# Altium project Design Project 2.PrjPcb
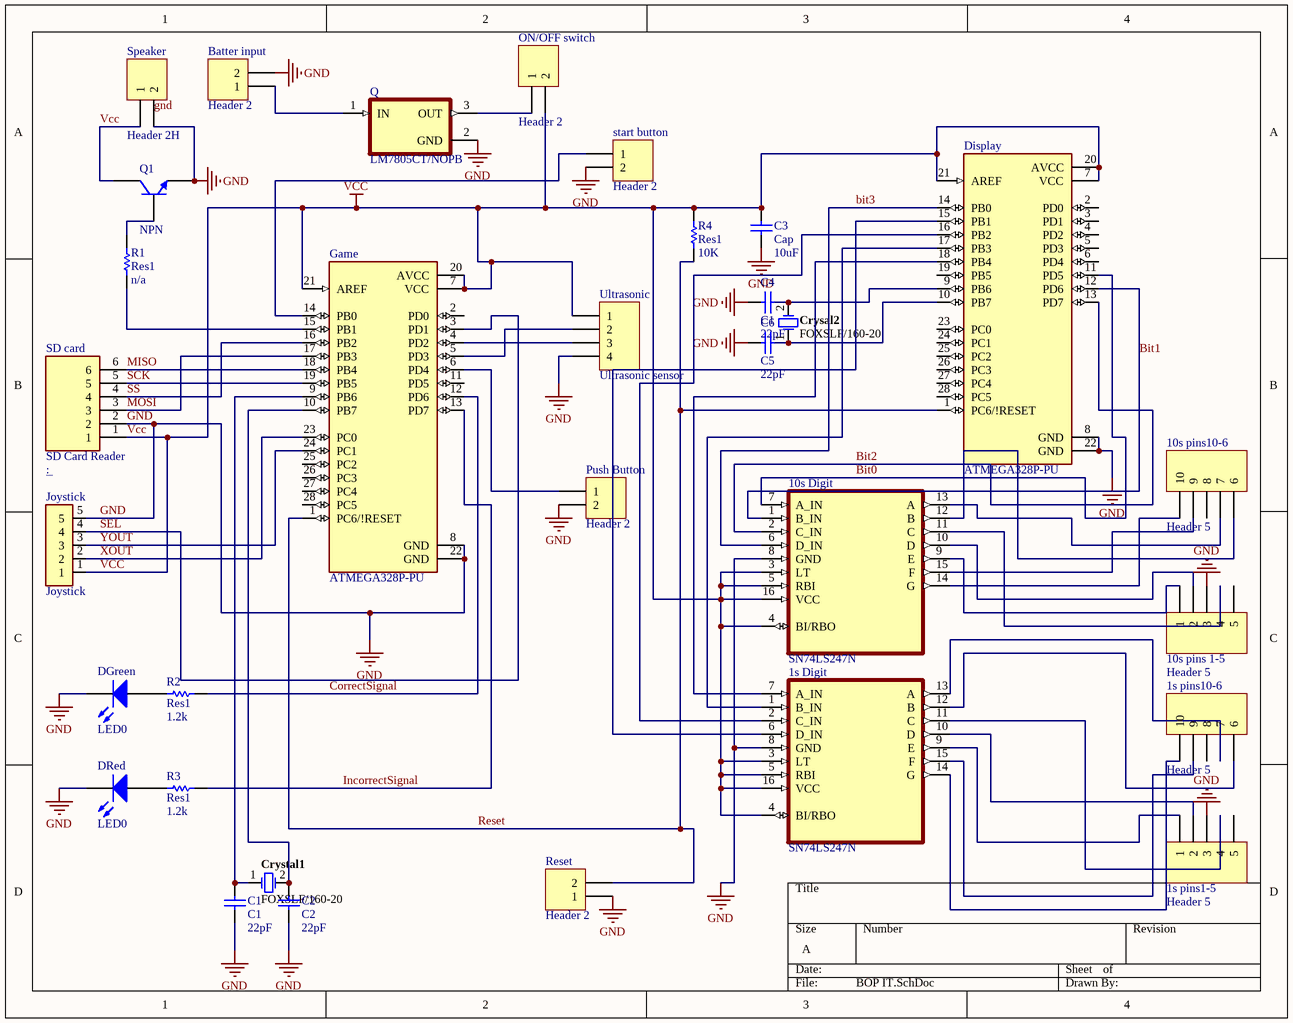
[diagram p0: BOP IT.SchDoc]
1 sheet, 32 parts. Net scope: global (net labels, ports and power ports of the same name join across sheets).
Board file: Bop_it.PcbDoc

## Sheet BOP IT.SchDoc
size A; SheetNumber: 1; SheetTotal: 1

### Parts
1s_Digit  SN74LS247N  [DIP794W45P254L1969H508Q16]
1s_pins1-5  Header 5  [HDR1X5]
1s_pins10-6  Header 5  [HDR1X5]
10s_Digit  SN74LS247N  [DIP794W45P254L1969H508Q16]
10s_pins10-6  Header 5  [HDR1X5]
10s_pins_1-5  Header 5  [HDR1X5]
Batter_input  Header 2  [HDR1X2]
C1  C1  value 22pF  [RAD-0.3]
C2  C2  value 22pF  [RAD-0.3]
C3  Cap  value 10uF  [RAD-0.3]
C4  C1  value 22pF  [RAD-0.3]
C6  C5  value 22pF  [RAD-0.3]
Crysal2  FOXSLF/160-20  [FOX-FOXSLF160-20]
Crystal1  FOXSLF/160-20  [FOX-FOXSLF160-20]
DGreen  LED0  [LED-0]
Display  ATMEGA328P-PU  [DIP794W46P254L2967H457Q28B]
DRed  LED0  [LED-0]
Game  ATMEGA328P-PU  [DIP794W46P254L2967H457Q28B]
Joystick  Joystick  [TE_826629-5]
ON/OFF_switch  Header 2  [HDR1X2]
Push_Button  Header 2  [HDR1X2]
Q  LM7805CT/NOPB  [TO254P1054X470X2600-3]
Q1  NPN  [TO-226-AA]
R1  Res1  [AXIAL-0.3]
R2  Res1  value 1.2k  [AXIAL-0.3]
R3  Res1  value 1.2k  [AXIAL-0.3]
R4  Res1  value 10K  [AXIAL-0.3]
Reset  Header 2  [HDR1X2]
SD_card  SD Card Reader  [TE_5-146285-6]
Speaker  Header 2H  [HDR1X2H]
start_button  Header 2  [HDR1X2]
Ultrasonic  Ultrasonic sensor  [HDR1X4]

### Nets
GND: 1s_Digit.8(GND) 1s_pins1-5.3 10s_Digit.8(GND) 10s_pins_1-5.3 Batter_input.2 C1.1 C2.1 C3.1 C4.2 C6.2 DGreen.2(K) Display.8(GND) Display.22(GND) DRed.2(K) Game.8(GND) Game.22(GND) Joystick.5 Push_Button.2 Q.2(GND) Q1.3(E) Reset.1 SD_card.2 Speaker.2 start_button.2 Ultrasonic.4
Vcc: 1s_Digit.3(LT) 1s_Digit.4(BI/RBO) 1s_Digit.5(RBI) 1s_Digit.16(VCC) 10s_Digit.3(LT) 10s_Digit.4(BI/RBO) 10s_Digit.5(RBI) 10s_Digit.16(VCC) C3.2 Display.7(VCC) Display.20(AVCC) Display.21(AREF) Game.7(VCC) Game.20(AVCC) Game.21(AREF) Joystick.1 ON/OFF_switch.2 Q1.1(C) R4.2 SD_card.1 Speaker.1 Ultrasonic.1
Bit0: 10s_Digit.7(A_IN) Display.11(PD5)
Bit1: 10s_Digit.1(B_IN) Display.12(PD6)
Bit2: 10s_Digit.2(C_IN) Display.13(PD7)
bit3: 10s_Digit.6(D_IN) Display.14(PB0)
CorrectSignal: Game.12(PD6) R2.2
IncorrectSignal: Game.13(PD7) R3.2
MISO: Game.18(PB4) SD_card.6
MOSI: Game.17(PB3) SD_card.3
Reset: Display.1(PC6/!RESET) Game.1(PC6/!RESET) R4.1 Reset.2
SCK: Game.19(PB5) SD_card.5
SEL: Game.3(PD1) Joystick.4
SS: Game.16(PB2) SD_card.4
XOUT: Game.23(PC0) Joystick.2
YOUT: Game.24(PC1) Joystick.3
Net1s_Digit_1: 1s_Digit.1(B_IN) Display.17(PB3)
Net1s_Digit_2: 1s_Digit.2(C_IN) Display.16(PB2)
Net1s_Digit_6: 1s_Digit.6(D_IN) Display.15(PB1)
Net1s_Digit_7: 1s_Digit.7(A_IN) Display.18(PB4)
Net1s_Digit_9: 1s_Digit.9(E) 1s_pins1-5.1
Net1s_Digit_10: 1s_Digit.10(D) 1s_pins1-5.2
Net1s_Digit_11: 1s_Digit.11(C) 1s_pins1-5.4
Net1s_Digit_12: 1s_Digit.12(B) 1s_pins10-6.6
Net1s_Digit_13: 1s_Digit.13(A) 1s_pins10-6.7
Net1s_Digit_14: 1s_Digit.14(G) 1s_pins10-6.10
Net1s_Digit_15: 1s_Digit.15(F) 1s_pins10-6.9
Net10s_Digit_9: 10s_Digit.9(E) 10s_pins_1-5.1
Net10s_Digit_10: 10s_Digit.10(D) 10s_pins_1-5.2
Net10s_Digit_11: 10s_Digit.11(C) 10s_pins_1-5.4
Net10s_Digit_12: 10s_Digit.12(B) 10s_pins10-6.6
Net10s_Digit_13: 10s_Digit.13(A) 10s_pins10-6.7
Net10s_Digit_14: 10s_Digit.14(G) 10s_pins10-6.10
Net10s_Digit_15: 10s_Digit.15(F) 10s_pins10-6.9
NetBatter_input_1: Batter_input.1 Q.1(IN)
NetC1_2: C1.2 Crystal1.1 Game.9(PB6)
NetC2_2: C2.2 Crystal1.2 Game.10(PB7)
NetC4_1: C4.1 Crysal2.2 Display.9(PB6)
NetC6_1: C6.1 Crysal2.1 Display.10(PB7)
NetDGreen_1: DGreen.1(A) R2.1
NetDRed_1: DRed.1(A) R3.1
NetGame_4: Game.4(PD2) Ultrasonic.3
NetGame_5: Game.5(PD3) Ultrasonic.2
NetGame_6: Game.6(PD4) Push_Button.1
NetGame_14: Game.14(PB0) start_button.1
NetGame_15: Game.15(PB1) R1.1
NetON/OFF_switch_1: ON/OFF_switch.1 Q.3(OUT)
NetQ1_2: Q1.2(B) R1.2

Not connected (* = marked no-connect by the designer): 1s_pins1-5 5; 1s_pins10-6 8; 10s_pins10-6 8; 10s_pins_1-5 5; Display 2(PD0) 3(PD1) 4(PD2) 5(PD3) 6(PD4) 19(PB5) 23(PC0) 24(PC1) 25(PC2) 26(PC3) 27(PC4) 28(PC5); Game 2(PD0) 11(PD5) 25(PC2) 26(PC3) 27(PC4) 28(PC5)

### Notes on the sheet
- Labels drawn without touching a wire or pin: gnd

### Library data of the parts
1s_Digit 10s_Digit = SN74LS247N: BCD-To-Seven-Segment Decoders/Drivers 16-PDIP 0 to 70; MF: Texas Instruments; Value: *; Check_prices: https://www.snapeda.com/parts/SN74LS247N/Texas%20Instruments/view-part/230215/?ref=eda; Package: PDIP-16 Texas Instruments; Digi-Key_Part_Number: 296-28943-2-ND; SnapEDA_Link: https://www.snapeda.com/parts/SN74LS247N/Texas%20Instruments/view-part/230215/?ref=snap; Purchase-URL: https://pricing.snapeda.com/search/part/SN74LS247N/?ref=eda; MP: SN74LS247N
1s_pins1-5 1s_pins10-6 10s_pins10-6 10s_pins_1-5 = Header 5: Header, 5-Pin; LatestRevisionDate: 17-Jul-2002; LatestRevisionNote: Re-released for DXP Platform.; Publisher: Altium Limited
Batter_input ON/OFF_switch Push_Button Reset start_button = Header 2: Header, 2-Pin; LatestRevisionDate: 17-Jul-2002; LatestRevisionNote: Re-released for DXP Platform.; Publisher: Altium Limited
C1-C4 C6 = Cap: Capacitor; Published: 8-Jun-2000; LatestRevisionDate: 17-Jul-2002; LatestRevisionNote: Re-released for DXP Platform.; PackageReference: RAD-0.3; Publisher: Altium Limited; PackageDescription: Radial Cap, Thru-Hole; 2 Leads; 0.3 in Pin Spacing
Crysal2 Crystal1 = CMP-1749-00003-1: Resistance Weld Thru-Hole Crystal, 16 MHz, -20 to 70 degC, 2-Pin THD, RoHS, Bulk; Voltage Rating: 250 V; Tolerance: 1%; Resistance: 221 kohm; Case\Package: Axial; Power Rating: 250 mW; RoHSCompliant: true; Package Quantity: 200; Packaging: Bulk; Min Operating Temperature: -55 degC; DatasheetVersion: Mar-15; ComponentLink1URL: http://www.foxonline.com/; Max Operating Temperature: 155 degC; PackageReference: FOXSLF160-20; Mount: Through Hole; PackageDescription: 2-Pin Through Hole Device, Body 11.35 x 4.65 mm; ComponentLink1Description: Manufacturer URL; ComponentLink2URL: http://www.foxonline.com/pdfs/hc49slf.pdf; ComponentLink2Description: Datasheet; Length: 0.248 inch
DGreen DRed = LED0: Typical INFRARED GaAs LED; Published: 8-Jun-2000; LatestRevisionDate: 08-Jul-2005; LatestRevisionNote: Mech Layer 1 removed.; PackageReference: LED-0; Publisher: Altium Limited; PackageDescription: LED; 2 Leads
Display Game = ATMEGA328P-PU: AVR AVRÂ® ATmega Microcontroller IC 8-Bit 20MHz 32KB _16K x 16_ FLASH 28-PDIP; MF: Microchip; Package: PDIP-28 Atmel; Value: *; Availability: Unavailable; SnapEDA_Link: https://www.snapeda.com/parts/ATMEGA328P-PU/Microchip/view-part/44282/?ref=snap; Price: None; MP: ATMEGA328P-PU
Joystick = 826629-5: Board-To-Board Connector, AMPMODU MOD II Series, Through Hole, Header, 5, 2.54 mm; Number_of_Positions: 5; Centerline_Pitch: 2.54 mm[.1 in]; MF: TE Connectivity; Product_Type: Connector; Availability: Unavailable; EU_RoHS_Compliance: Compliant; Package: None; MP: 826629-5; TE_purchase_URL: https://www.te.com/usa-en/product-826629-5.html?te_bu=Cor&te_type=disp&te_campaign=seda_glo_cor-seda-global-disp-prtnr-fy19-seda-model-bom-cta_sma-317_1&elqCampaignId=32493; SnapEDA_Link: https://www.snapeda.com/parts/826629-5/TE%20Connectivity%20AMP%20Connectors/view-part/905319/?ref=snap; Price: None; Value: *
Q = LM7805CT/NOPB: Linear Voltage Regulator IC 1 Output 1A TO-220-3; MF: ON Semiconductor; MP: LM7805CT; SnapEDA_Link: https://www.snapeda.com/parts/LM7805CT/ON%20Semiconductor/view-part/546231/?ref=snap; Price: None; Package: TO-220 ON Semiconductor; Value: *; Availability: Unavailable
Q1 = NPN: NPN Bipolar Transistor; Published: 8-Jun-2000; LatestRevisionDate: 17-Jul-2002; LatestRevisionNote: Re-released for DXP Platform.; PackageReference: TO-226-AA; Publisher: Altium Limited; PackageDescription: TO, Flat Index; 3 In-Line, Axial Leads; Body Dia. 4.8mm; Leads 0.55 x 0.51 mm (max); Code_JEDEC: TO-226-AA
R1-R4 = Res1: Resistor; Published: 8-Jun-2000; LatestRevisionDate: 17-Jul-2002; LatestRevisionNote: Re-released for DXP Platform.; PackageReference: AXIAL-0.3; Publisher: Altium Limited; PackageDescription: Axial Device, Thru-Hole; 2 Leads; 0.3 in Pin Spacing
  R1: Value: n/a
SD_card = 5-146285-6: Connector Header Through Hole 6 position 0.100 (2.54mm); MF: TE Connectivity; DigiKey-Purchase-URL: https://snapeda.com/shop?store=DigiKey&id=2411669; EU_RoHS_Compliance: Compliant; Package: None; MP: 5-146285-6; Value: *; SnapEDA_Link: https://www.snapeda.com/parts/5-146285-6/TE%20Connectivity%20AMP%20Connectors/view-part/2411669/?ref=snap; Digi-Key_Part_Number: A122872-ND
Speaker = Header 2H: Header, 2-Pin, Right Angle; LatestRevisionDate: 17-Jul-2002; LatestRevisionNote: Re-released for DXP Platform.; Publisher: Altium Limited
Ultrasonic = Header 4: Header, 4-Pin; LatestRevisionDate: 17-Jul-2002; LatestRevisionNote: Re-released for DXP Platform.; Publisher: Altium Limited